# EAGLE design LightStickControl (EAGLE 7.7.0)
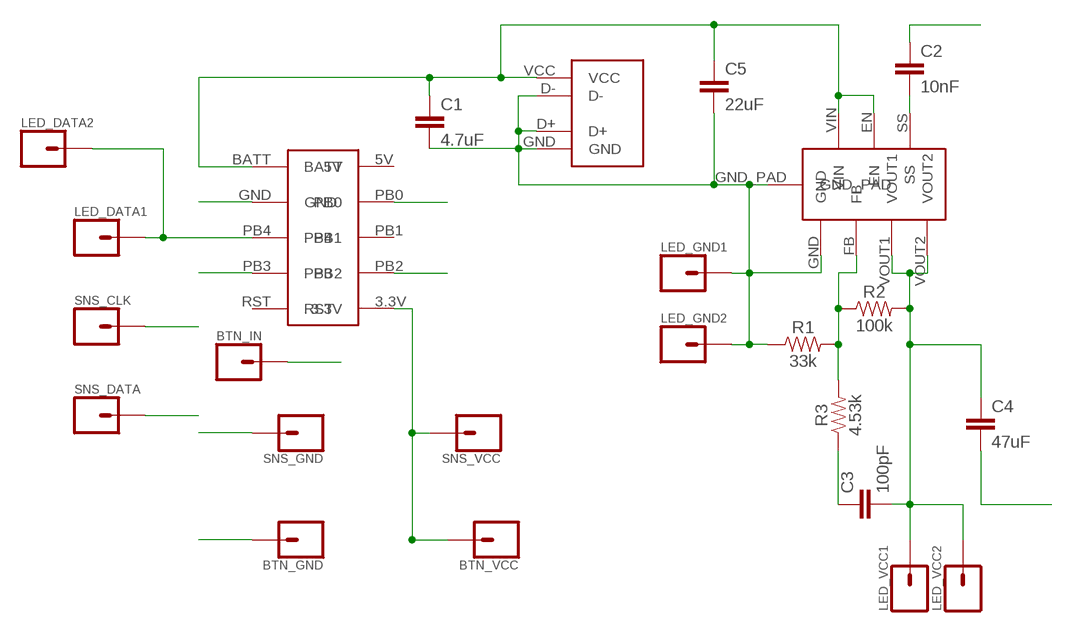
[diagram p0: schematic, sheet 1]

## Parts
BTN_GND  CONN_01  [1X01]
BTN_IN  CONN_01  [1X01]
BTN_VCC  CONN_01  [1X01]
C1  4.7uF  4.7UF0603  [0603]
C2  10nF  10NF-0603-50V-10%  [0603]
C3  100pF  100PF-0603-50V-5%  [0603]
C4  47uF  22UF-0805-6.3V-20%  [0805]
C5  22uF  22UF-0805-6.3V-20%  [0805]
LED_DATA1  CONN_01  [1X01]
LED_DATA2  CONN_01  [1X01]
LED_GND1  CONN_01  [1X01]
LED_GND2  CONN_01  [1X01]
LED_VCC1  CONN_01  [1X01]
LED_VCC2  CONN_01  [1X01]
MCU1  ARDUINO_TRINKET  [ARDUINO_TRINKET]
R1  33k  33KOHM-0603-1/10W-1%  [0603]
R2  100k  100KOHM-0603-1/10W-1%  [0603]
R3  4.53k  4.7KOHM-0603-1/10W-1%  [0603]
SNS_CLK  CONN_01  [1X01]
SNS_DATA  CONN_01  [1X01]
SNS_GND  CONN_01  [1X01]
SNS_VCC  CONN_01  [1X01]
USB1  USB_A_932  [USB_A_932]
V1  LMZ10503  [TO-PMOD]

## Nets
BTN_IN: BTN_IN.1 MCU1.PB3
FB: R1.2 R2.1 R3.2 V1.FB
GND: BTN_GND.1 C1.2 C2.1 C4.2 C5.2 LED_GND1.1 LED_GND2.1 MCU1.GND R1.1 SNS_GND.1 USB1.D+ USB1.D- USB1.GND V1.GND V1.GND_PAD
LED_DATA: LED_DATA1.1 LED_DATA2.1 MCU1.PB4
SNS_CLK: MCU1.PB2 SNS_CLK.1
SNS_DATA: MCU1.PB0 SNS_DATA.1
SNS_VCC: BTN_VCC.1 MCU1.3.3V SNS_VCC.1
SS: C2.2 V1.SS
VCC_IN: C1.1 C5.1 MCU1.BATT USB1.VCC V1.EN V1.VIN
VOUT: C3.2 C4.1 LED_VCC1.1 LED_VCC2.1 R2.2 V1.VOUT1 V1.VOUT2
VOUT_C: C3.1 R3.1
Unconnected: MCU1.5V MCU1.PB1 MCU1.RST

## Library data of the parts
BTN_GND BTN_IN BTN_VCC LED_DATA1 LED_DATA2 LED_GND1 LED_GND2 LED_VCC1 LED_VCC2 SNS_CLK SNS_DATA SNS_GND SNS_VCC = SparkFun-Connectors:CONN_01: Single connection point. Often used as Generic Header-pin footprint for 0.1 inch spaced/style header connections On any of the 0.1 inch spaced packages, you can populate with these: Break Away Headers - Straight <https://www.sparkfun.com/products/116> (PRT-00116) Break Away Male Headers - Right Angle <https://www.sparkfun.com/products/553> (PRT-00553) Female Headers <https://www.sparkfun.com/products/115> (PRT-00115) Break Away Headers - Machine Pin <https://www.sparkfun.com/products/117> (PRT-00117) Break Away Female Headers - Swiss Machine Pin <https://www.sparkfun.com/products/743> (PRT-00743) This device is also useful as a general connection point to wire up your design to another part of your project. Our various solder wires solder well into these plated through hole pads. Hook-Up Wire - Assortment (Stranded, 22 AWG) <https://www.sparkfun.com/products/11375> (PRT-11375) Hook-Up Wire - Assortment (Solid Core, 22 AWG) <https://www.sparkfun.com/products/11367> (PRT-11367) View the entire wire category on our website here <https://www.sparkfun.com/categories/141> Special notes: SMTSO-256-ET is a "flush mount" nut for a 4-40 screw. We mostly use this on specialty testbeds; it is a nice way to connect hardware to your PCB at an adjustable hieght. Also note, the SNAP packages are for using a snappable style connector. We sell a baggie of snaps and they are also used on two LilyPad designs: Snap Assortment - 30 pack (male and female) <https://www.sparkfun.com/products/11347> (DEV-11347) LilyPad Arduino SimpleSnap <https://www.sparkfun.com/products/10941> (DEV-10941) LilyPad SimpleSnap Protoboard <https://www.sparkfun.com/products/10940> (DEV-10940)
C1 = SparkFun-Capacitors:4.7UF: 4.7µF ceramic capacitors A capacitor is a passive two-terminal electrical component used to store electrical energy temporarily in an electric field.; PROD_ID: CAP-08280
C2 = SparkFun-Capacitors:10NF: 0.01uF/10nF/10,000pF ceramic capacitors A capacitor is a passive two-terminal electrical component used to store electrical energy temporarily in an electric field. CAP-09321; PROD_ID: CAP-00867
C3 = SparkFun-Capacitors:100PF: 100pF/0.1nF ceramic capacitors A capacitor is a passive two-terminal electrical component used to store electrical energy temporarily in an electric field.; PROD_ID: CAP-07883
C4 = SparkFun-Capacitors:22UF: 22µF ceramic capacitors A capacitor is a passive two-terminal electrical component used to store electrical energy temporarily in an electric field.; PROD_ID: CAP-08402; VALUE: 22uF
C5 = SparkFun-Capacitors:22UF: 22µF ceramic capacitors A capacitor is a passive two-terminal electrical component used to store electrical energy temporarily in an electric field.; PROD_ID: CAP-08402
MCU1 = trinketLib:ARDUINO_TRINKET: Microcontroller package Arduino Trinket by Adafruit. 3.3V variety.
R1 = SparkFun-Resistors:33KOHM: 33kΩ resistor A resistor is a passive two-terminal electrical component that implements electrical resistance as a circuit element. Resistors act to reduce current flow, and, at the same time, act to lower voltage levels within circuits. - Wikipedia; PROD_ID: RES-08416
R2 = SparkFun-Resistors:100KOHM: 100kΩ resistor A resistor is a passive two-terminal electrical component that implements electrical resistance as a circuit element. Resistors act to reduce current flow, and, at the same time, act to lower voltage levels within circuits. - Wikipedia; PROD_ID: RES-07828
R3 = SparkFun-Resistors:4.7KOHM: 4.7kΩ resistor A resistor is a passive two-terminal electrical component that implements electrical resistance as a circuit element. Resistors act to reduce current flow, and, at the same time, act to lower voltage levels within circuits. - Wikipedia; PROD_ID: RES-07857; VALUE: 4.7k
USB1 = freddyLibr:USB_A_932: USB A Plug. Through hole.
V1 = freddyLibr:LMZ10503: Switcher voltage regulator

## Board
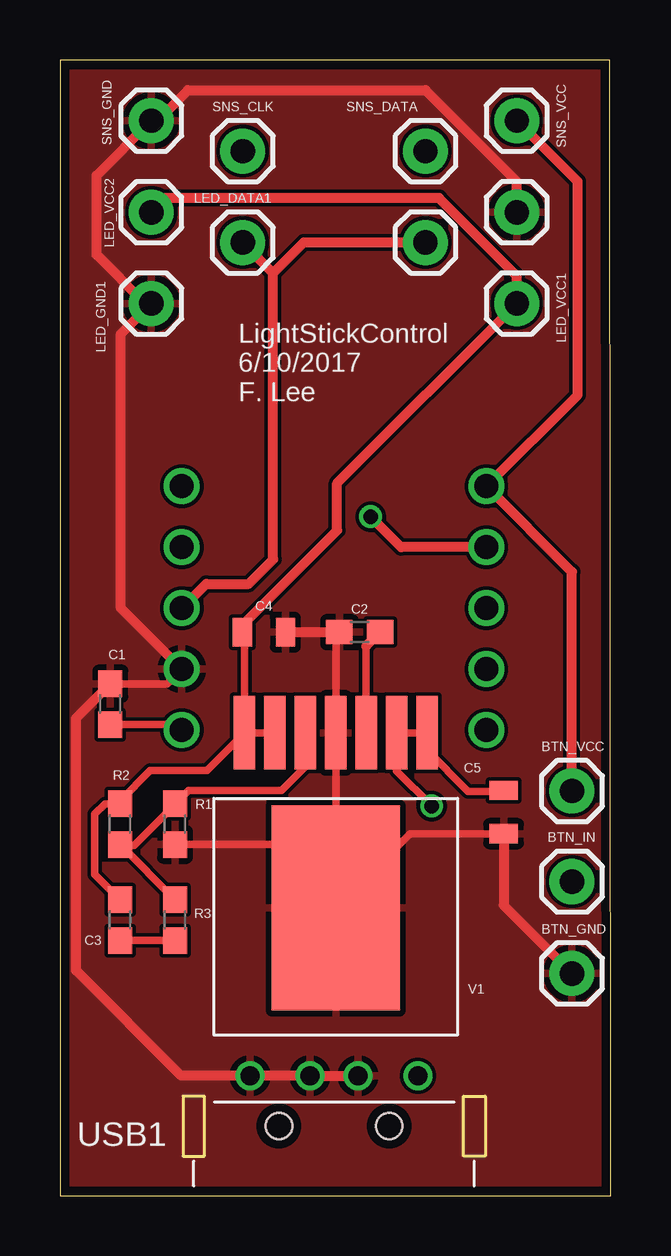
[diagram p1: board, top side]
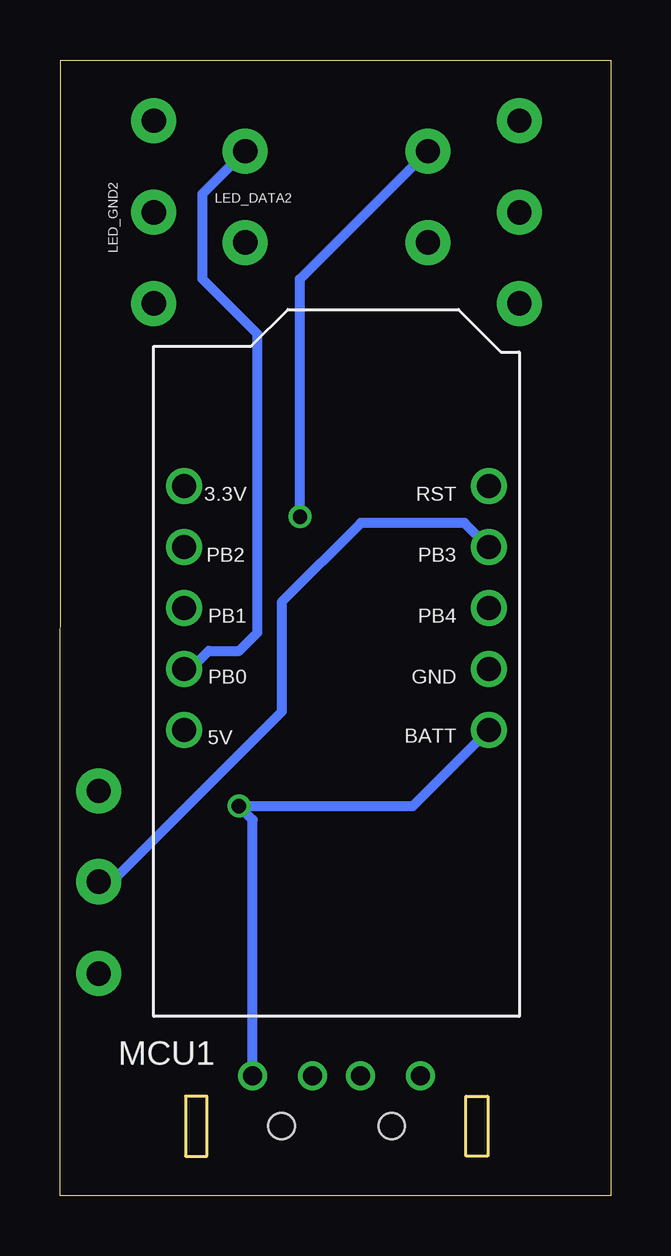
[diagram p2: board, bottom side, seen from below]

Size 22.96 x 47.35 mm. Coordinates in mm from the lower left corner, seen from the top.
Outline: 0,0 22.96,0 22.94,47.35 0,47.35 0,0
Copper layers (1*16): Top 0.0356mm / dielectric 1.5011mm / Bottom 0.0356mm
Design rules "LaenPCBOrder": minimum track width 6mil, minimum drill 13mil, track to track 6mil, track to pad 6mil, pad to pad 6mil, via to via 6mil, smd to smd 6mil, copper to edge 15mil, drill to drill 6mil, minimum pad ring 7mil, minimum via ring 7mil, stop-mask expansion 3mil, vias tented up to drill 0mil, thermal gap 10mil

### Footprints (pad centres in the part's own frame; a part is rotated, then mirrored left to right if it is on the bottom)
1X01 = drill 1.016 pad 1.88: 1 0,0
0603 = smd 1.1 x 1: 1 -0.85,0; 2 0.85,0
0805 = smd 0.8 x 1.2: 1 -0.9,0; 2 0.9,0
ARDUINO_TRINKET = drill 1: 3.3V 6.35,-5.08; 5V 6.35,5.08; BATT -6.35,5.08; GND -6.35,2.54; PB0 6.35,2.54; PB1 6.35,0; PB2 6.35,-2.54; PB3 -6.35,-2.54; PB4 -6.35,0; RST -6.35,-5.08
USB_A_932 = drill 0.8: D+ 1,-2.1; D- -1,-2.1; GND 3.5,-2.1; VCC -3.5,-2.1 | hole 1.1: -2.3,0; 2.3,0
TO-PMOD = smd 0.89 x 3.06: EN -2.54,-7.3; FB 1.27,-7.3; GND 0,-7.3; SS -1.27,-7.3; VIN -3.81,-7.3; VOUT1 2.54,-7.3; VOUT2 3.81,-7.3 | smd 5.35 x 8.54: GND_PAD 0,0

### Placement (x,y rotation side)
BTN_GND  21.35,9.27 0 top
BTN_IN  21.35,13.1 0 top
BTN_VCC  21.35,16.88 0 top
C1  2.1,20.5 90 top
C2  12.5,23.5 0 top
C3  2.5,11.5 90 top
C4  8.5,23.5 0 top
C5  18.5,16 270 top
LED_DATA1  7.62,39.74 0 top
LED_DATA2  15.24,39.74 0 top
LED_GND1  3.81,37.2 90 top
LED_GND2  19.05,41 270 top
LED_VCC1  19.05,37.2 270 top
LED_VCC2  3.81,41 0 top
MCU1  11.43,24.5 180 bottom
R1  4.8,15.5 90 top
R2  2.5,15.5 90 top
R3  4.8,11.5 90 top
SNS_CLK  7.62,43.55 0 top
SNS_DATA  15.24,43.55 0 top
SNS_GND  3.81,44.82 90 top
SNS_VCC  19.05,44.82 270 top
USB1  11.43,2.91 180 top
V1  11.5,12 180 top

### Tracks (layer width: path | path; a pad name or v marks a point on that pad's centre or on a via)
BTN_IN
  Bottom 0.406: MCU1.PB3 6.1,28.06 10.41,28.06 13.72,24.75 13.72,20.18 20.8,13.1 BTN_IN.1
FB
  Top 0.305: V1.FB 10.23,17.91 9.23,16.91 5.36,16.91 R1.2 | 4.8,16.32 3.1,14.62 2.53,14.62 | R3.2 R2.1
  Top 0.406: R1.2 4.8,16.32 | 2.53,14.62 R2.1
GND
  Top 0.305: C1.2 4.47,21.35 MCU1.GND | 11.5,23.35 V1.GND V1.GND_PAD | C5.2 14.6,15.1 V1.GND_PAD | R1.1 11.5,14.65 V1.GND_PAD
  Top 0.406: USB1.D- USB1.D+ USB1.GND 5.06,5.01 0.67,9.4 0.67,19.92 C1.2 | MCU1.GND 2.54,24.5 2.54,35.93 LED_GND1.1 | 3.56,37.2 1.52,39.23 1.52,42.53 SNS_GND.1 4.06,44.82 5.33,46.09 15.24,46.09 19.05,42.28 LED_GND2.1 | 11.5,23.35 C2.1 C4.2 | C5.2 18.5,12.12 BTN_GND.1
  pour Top: 0,47.35 22.96,47.35 22.96,0 0,0
LED_DATA
  Top 0.406: MCU1.PB4 6.1,25.52 7.87,25.52 8.89,26.53 8.89,38.47 | 8.89,38.47 LED_DATA1.1 | LED_DATA2.1 10.16,39.74 8.89,38.47
SNS_CLK  (via drill 0.6)
  Top 0.406: MCU1.PB2 14.22,27.04 v12.95,28.31
  Bottom 0.406: v12.95,28.31 12.95,38.22 SNS_CLK.1
SNS_DATA
  Bottom 0.406: MCU1.PB0 17.53,21.96 16.76,22.72 15.49,22.72 14.73,23.48 14.73,35.93 17.02,38.22 17.02,41.77 SNS_DATA.1
SNS_VCC
  Top 0.406: SNS_VCC.1 21.59,42.28 21.59,33.39 MCU1.3.3V 21.35,26.01 BTN_VCC.1
SS
  Top 0.305: V1.SS 12.77,22.92
  Top 0.406: 12.77,22.92 C2.2
VCC_IN  (via drill 0.6)
  Top 0.305: C1.1 4.85,19.65 | 18.47,16.87 17.02,16.87 15.31,18.58 V1.VIN V1.EN 14.04,17.71 v15.5,16.25
  Top 0.406: 4.85,19.65 MCU1.BATT | 18.47,16.87 C5.1
  Bottom 0.406: MCU1.BATT 8.25,16.25 v15.5,16.25 14.93,15.68 USB1.VCC
VOUT
  Top 0.305: 2.5,16.47 3.77,17.74 6.13,17.74 V1.VOUT2 | V1.VOUT2 V1.VOUT1 | V1.VOUT2 7.69,23.41 | R2.2 1.88,16.35 1.45,15.92 1.45,13.4 C3.2
  Top 0.406: R2.2 2.5,16.47 | 7.69,23.41 C4.1 7.6,23.78 11.56,27.74 11.56,29.71 LED_VCC1.1 19.05,38.35 15.81,41.59 4.4,41.59 LED_VCC2.1
VOUT_C
  Top 0.305: C3.1 R3.1

### Text on the board
tNames: LightStickControl / 6/10/2017 / F. Lee